# Altium schematic sheet PFC_Interleaved_V8.1.SchDoc
size 889 x 762 mm
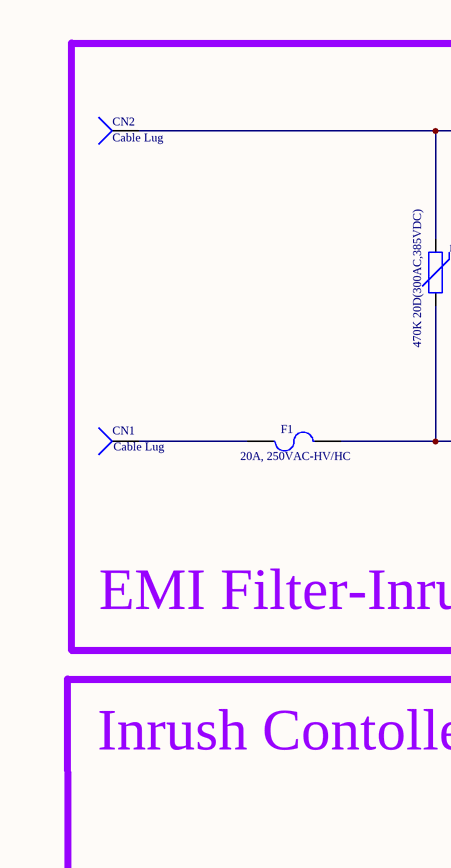
[diagram p0: PFC_Interleaved_V8.1.SchDoc, top left]
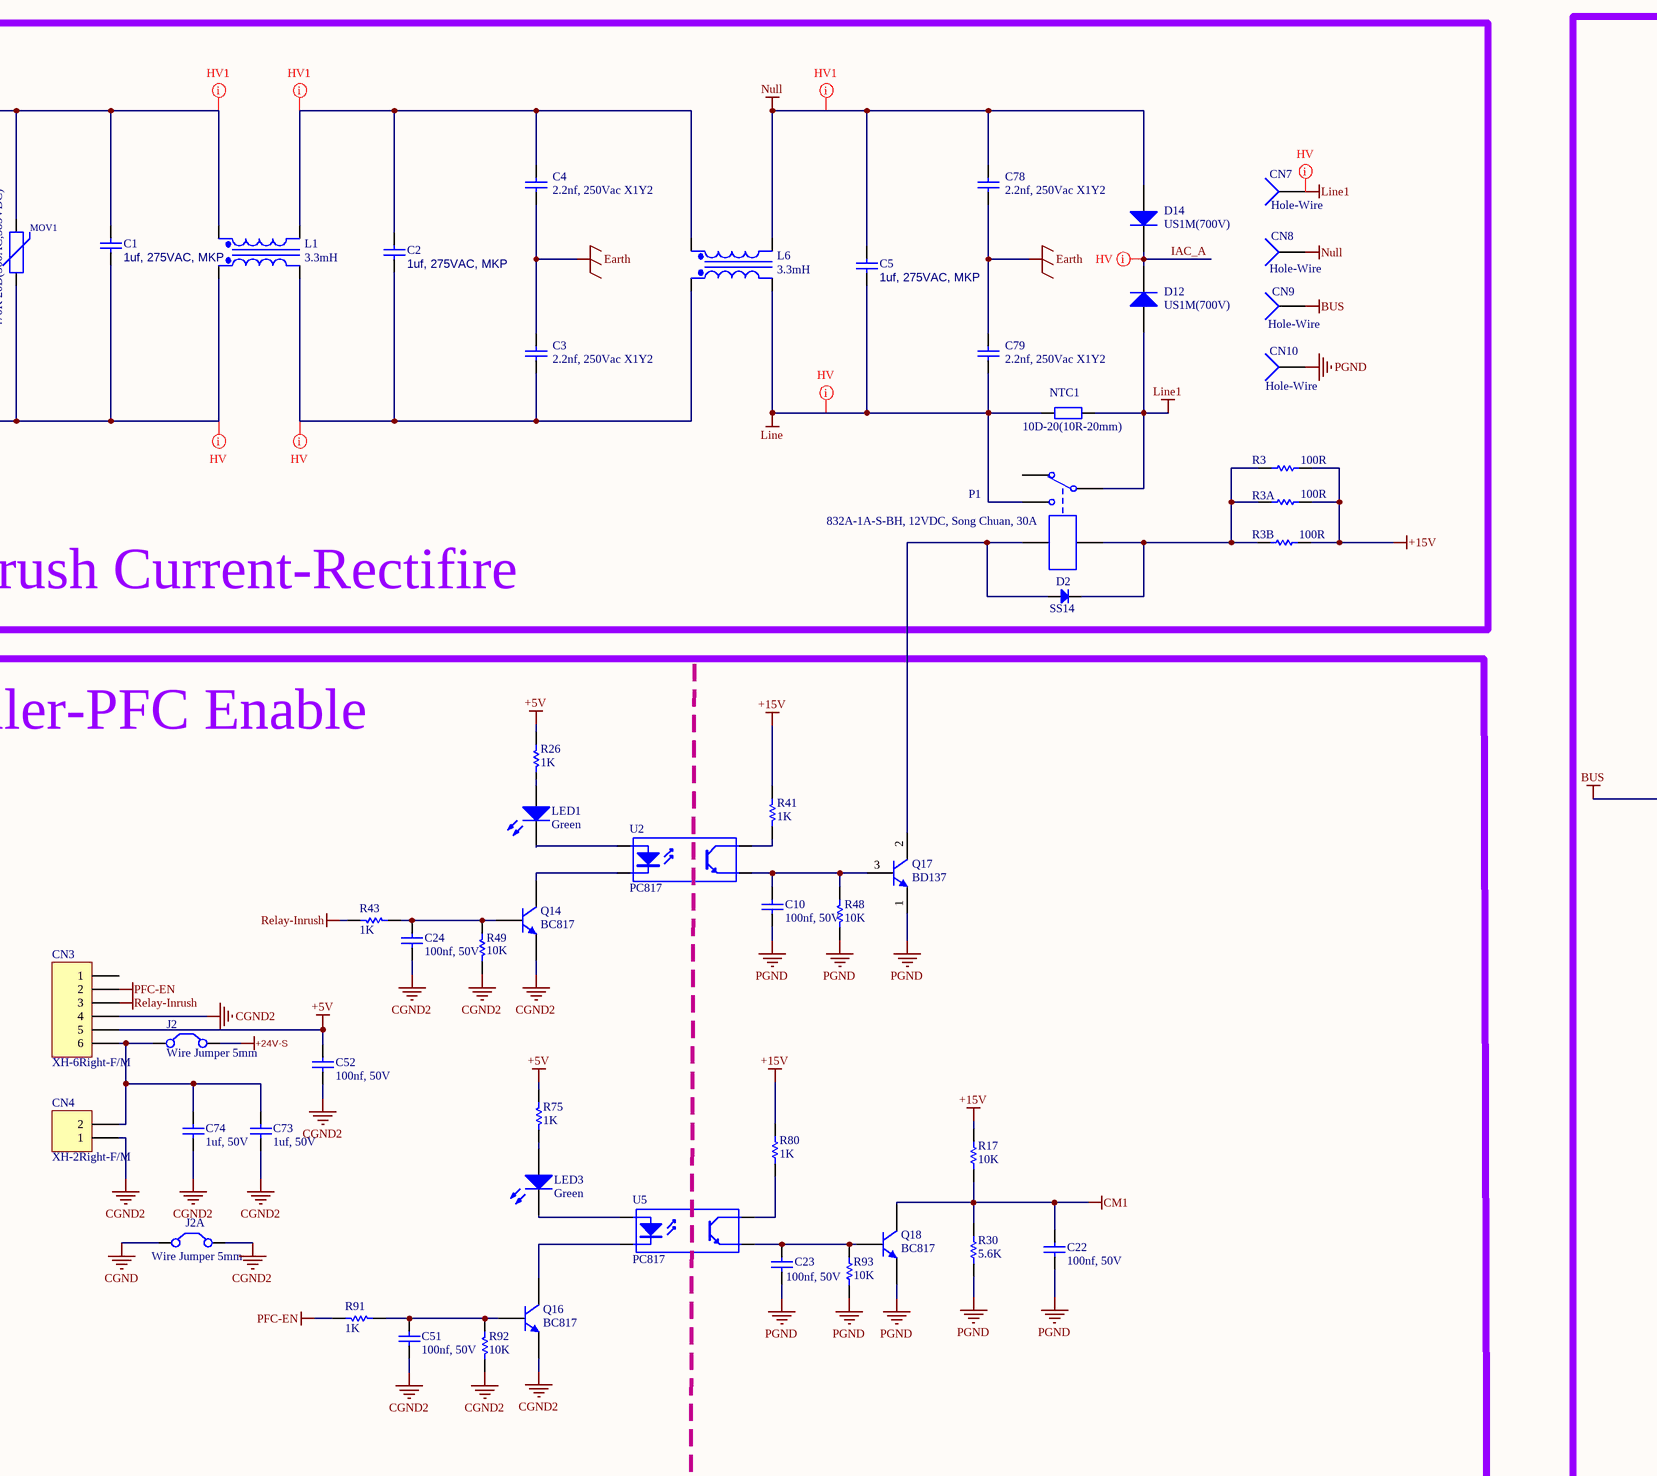
[diagram p1: PFC_Interleaved_V8.1.SchDoc, top middle]
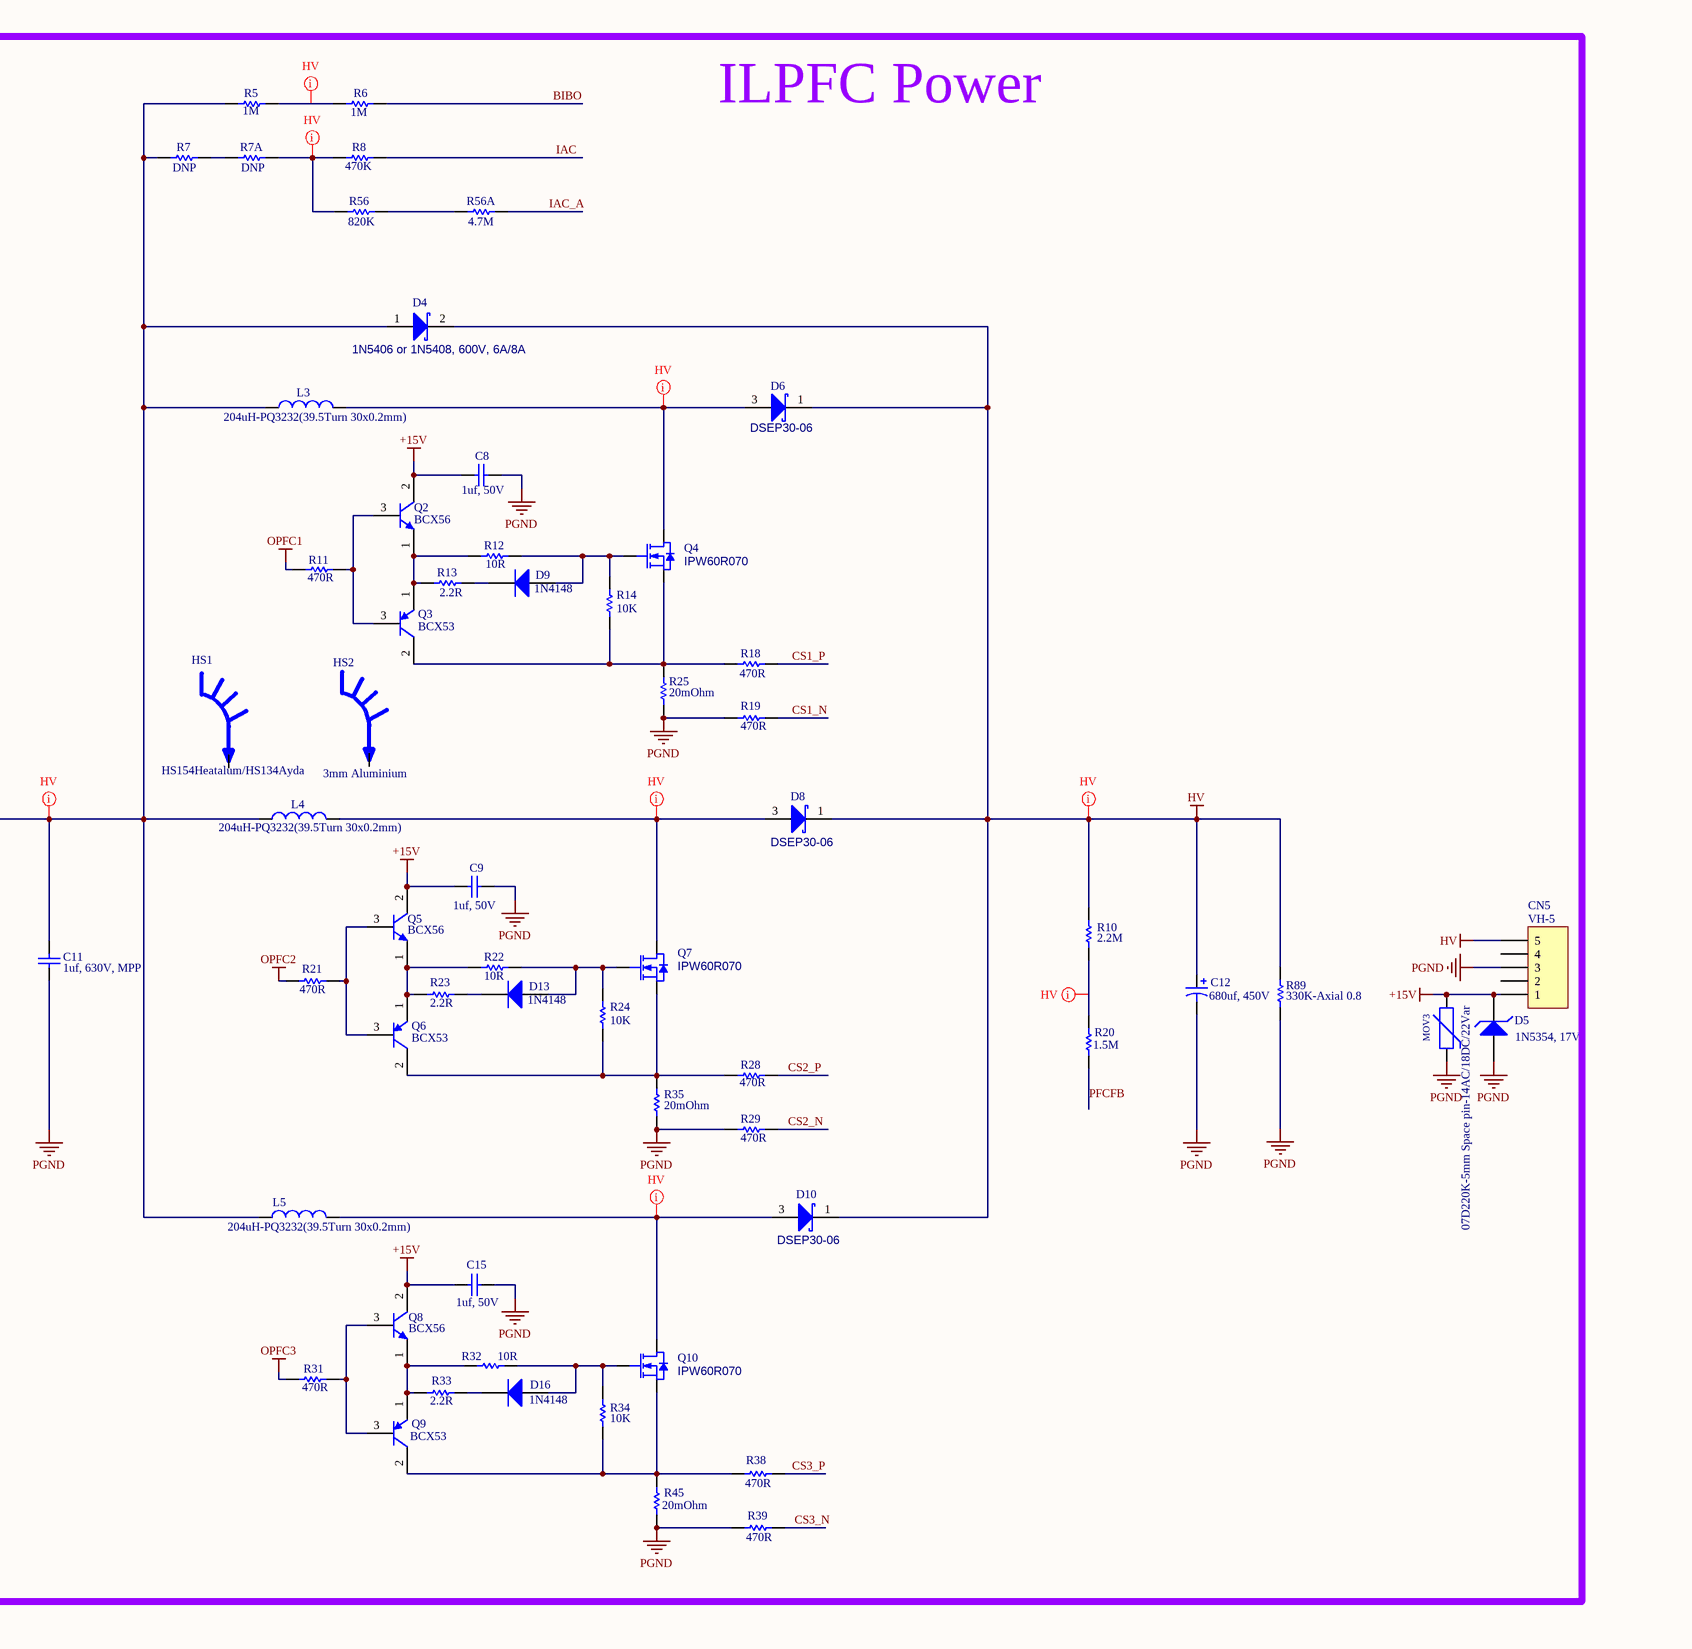
[diagram p2: PFC_Interleaved_V8.1.SchDoc, top right]
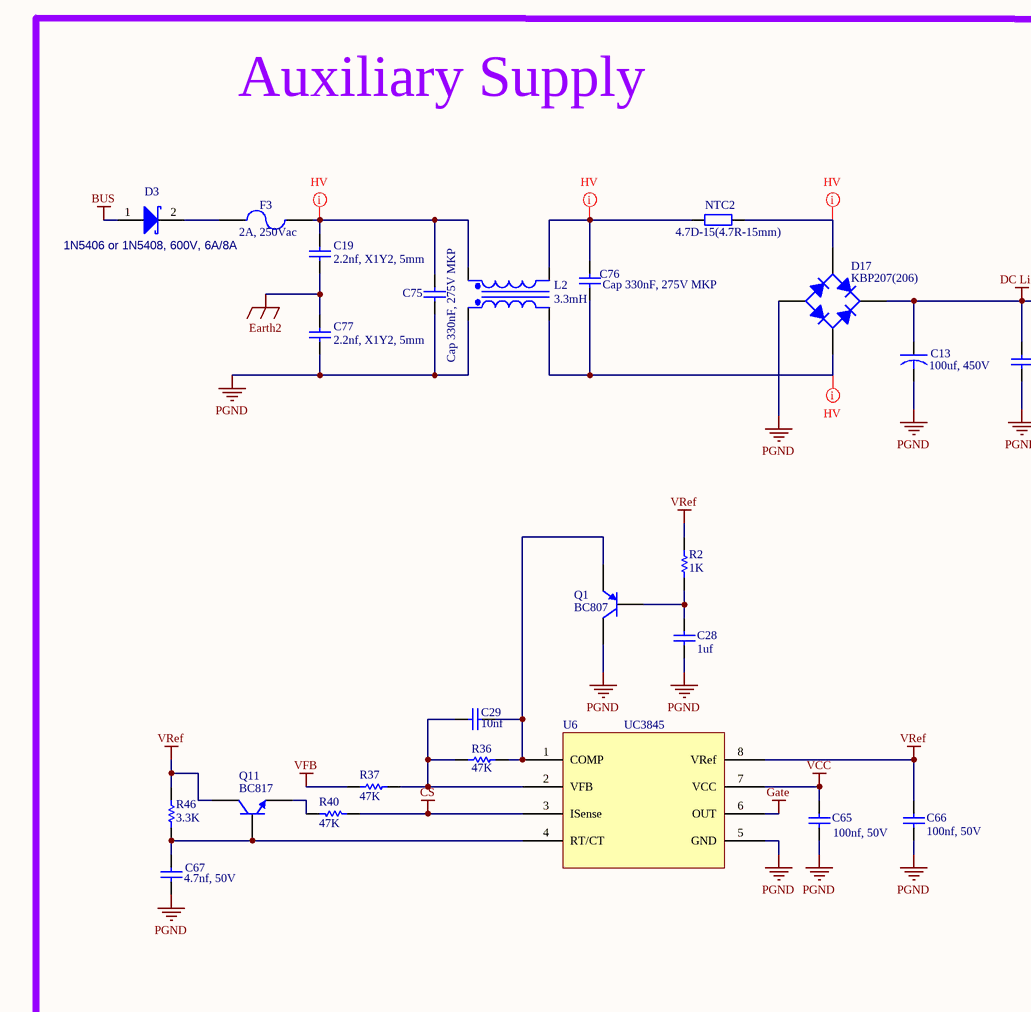
[diagram p3: PFC_Interleaved_V8.1.SchDoc, bottom left]
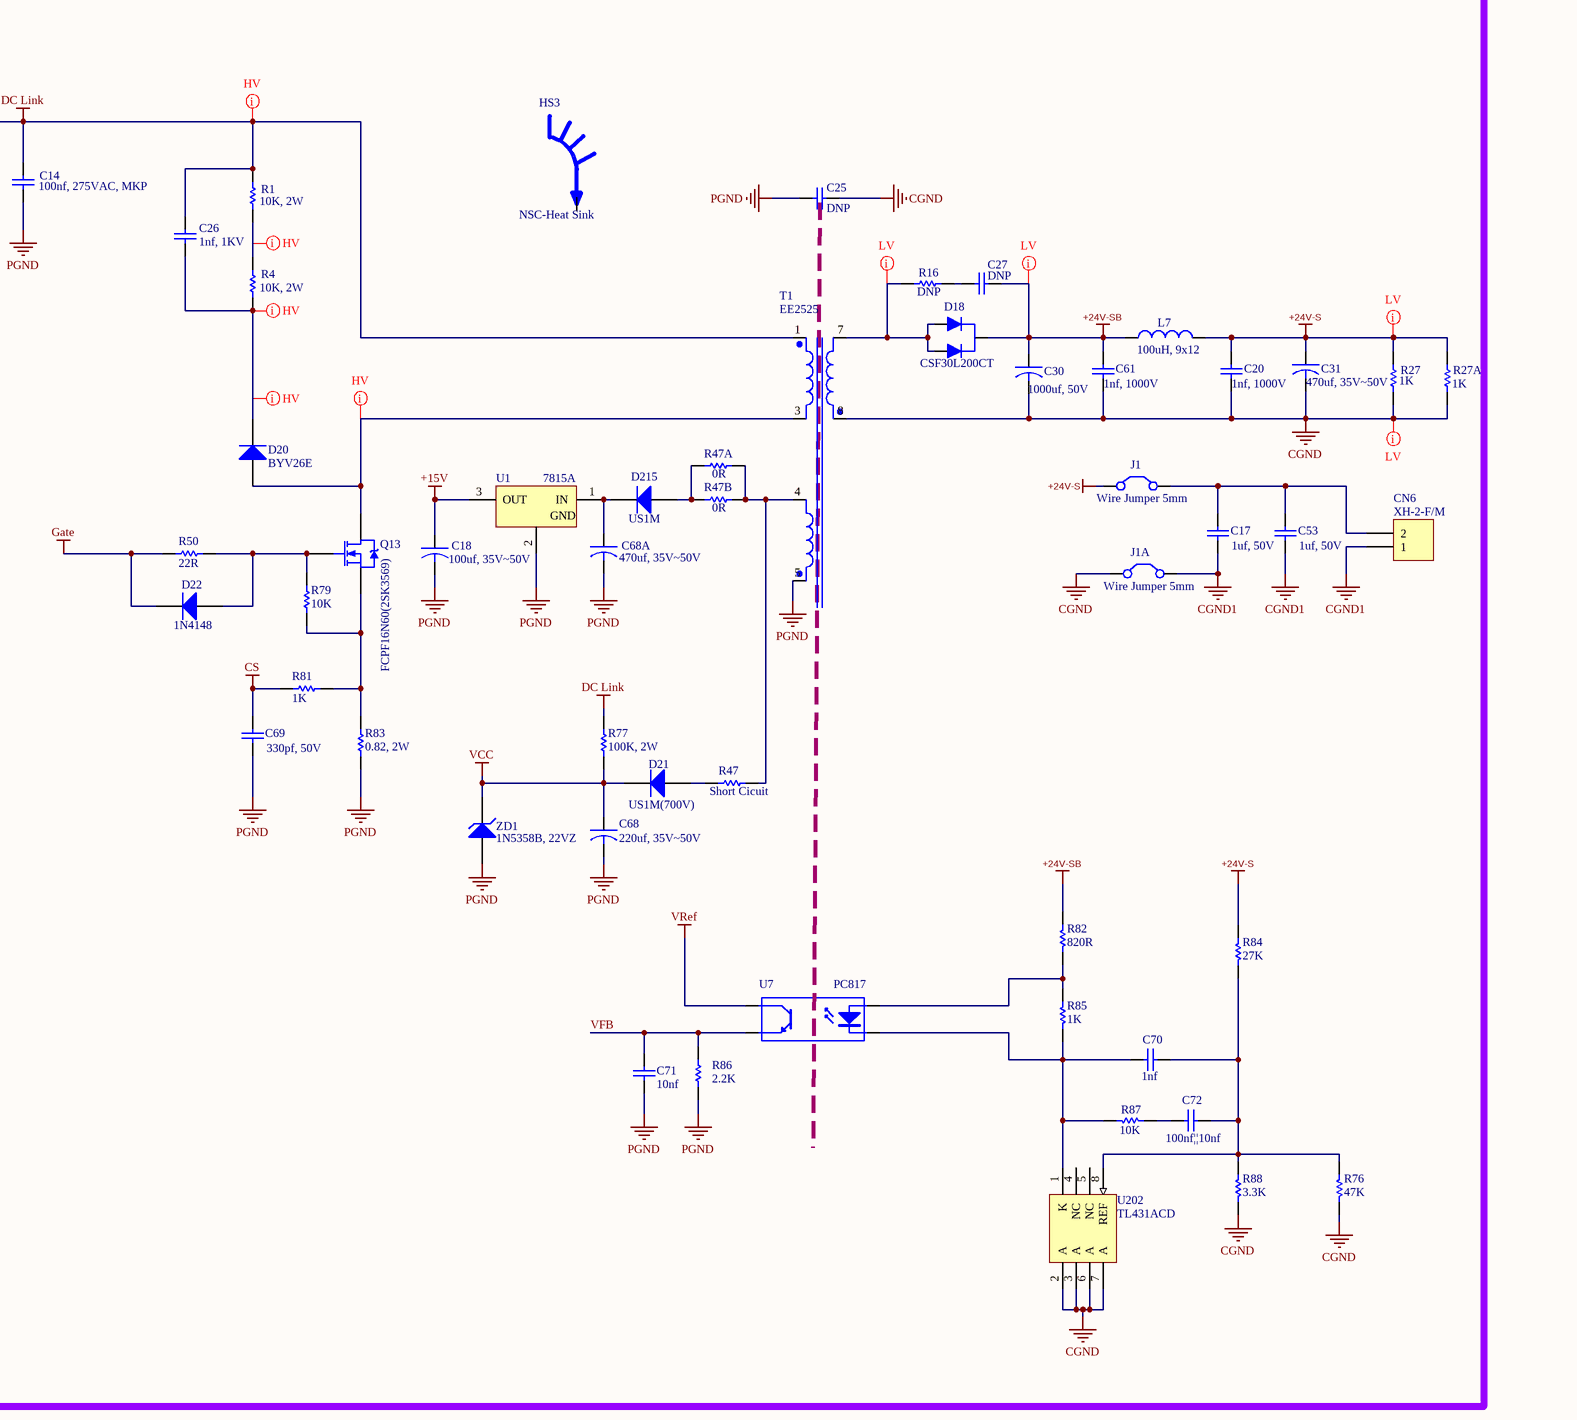
[diagram p4: PFC_Interleaved_V8.1.SchDoc, bottom middle]
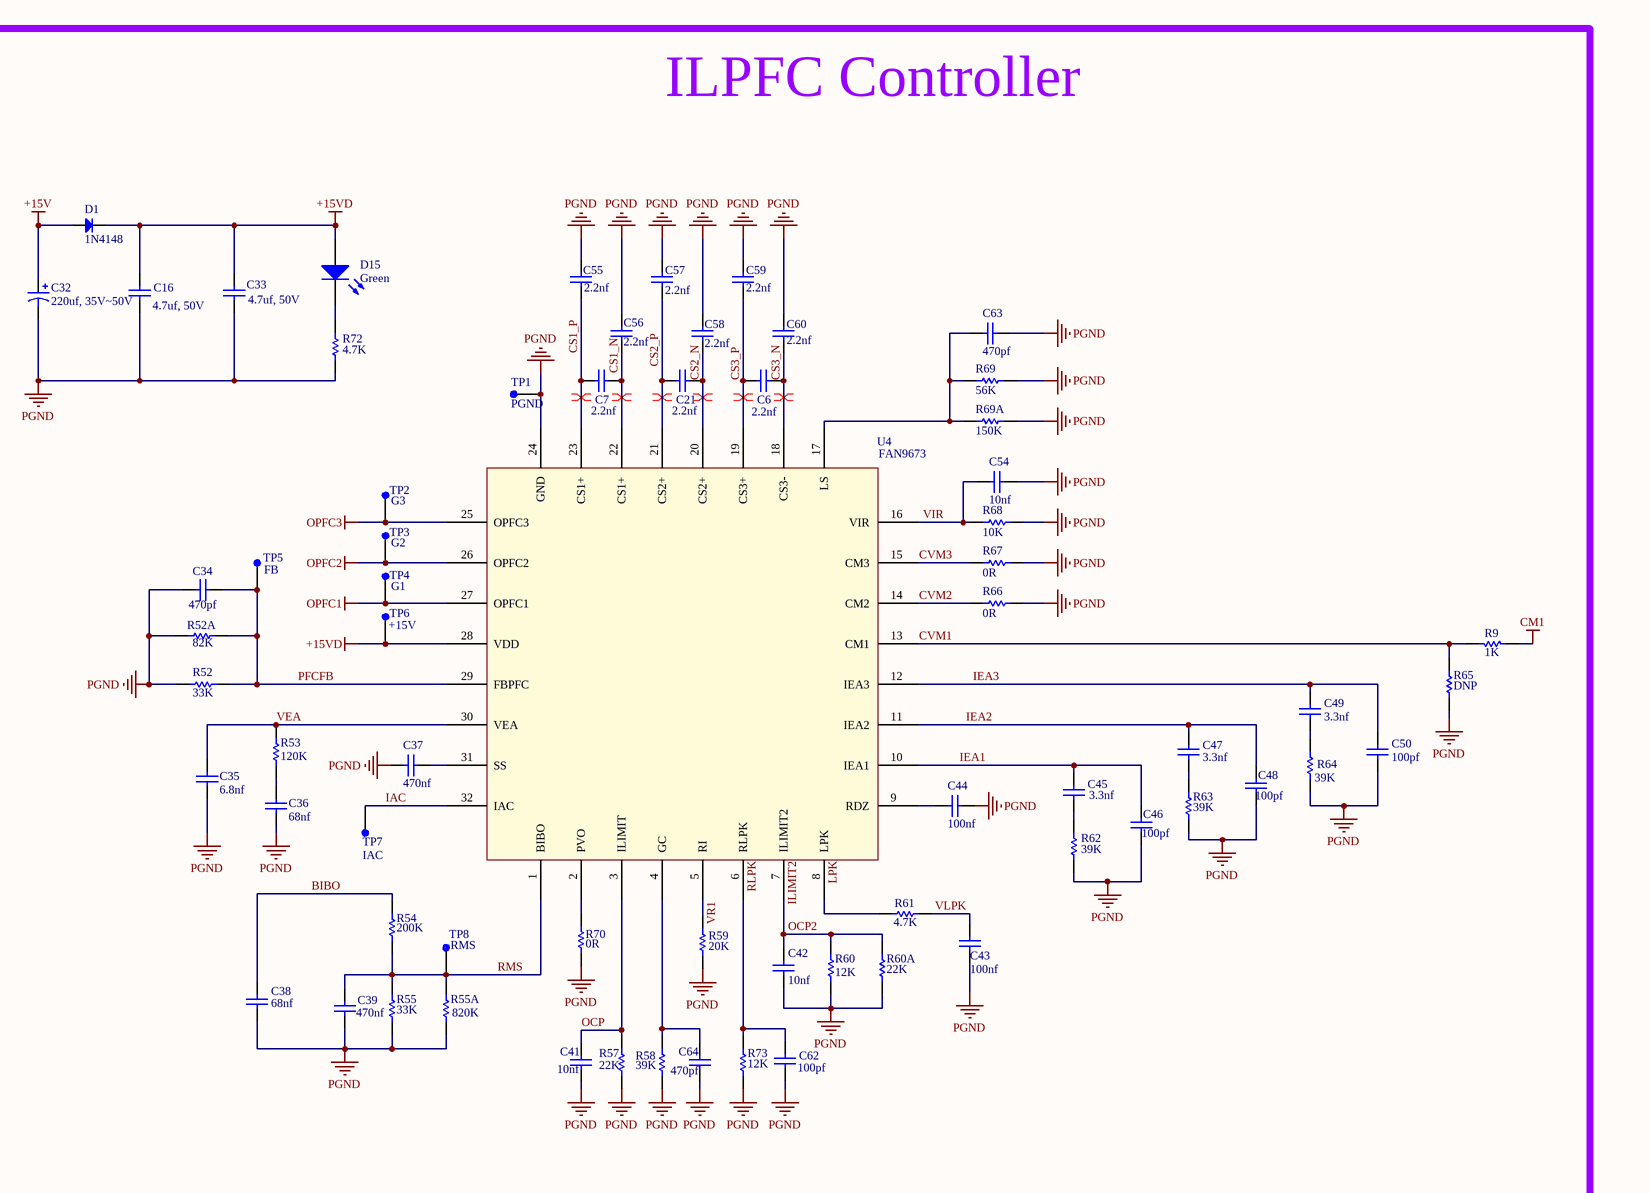
[diagram p5: PFC_Interleaved_V8.1.SchDoc, bottom right]

## Parts
C1  1uf, 275VAC, MKP  [CAP-15mm-22mm-MKT-Qourum]
C2  1uf, 275VAC, MKP  [CAP-15mm-22mm-MKT-Qourum]
C3  2.2nf, 250Vac X1Y2  [CAP-RAD-7.5mm-PFC]
C4  2.2nf, 250Vac X1Y2  [CAP-RAD-7.5mm-PFC]
C5  1uf, 275VAC, MKP  [CAP-15mm-22mm-MKT-Qourum]
C6  2.2nf  [C-0805]
C7  2.2nf  [C-0805]
C8  1uf, 50V  [C-0805]
C9  1uf, 50V  [C-0805]
C10  100nf, 50V  [C-0805]
C11  1uf, 630V, MPP  [CAP-15mm-22mm-MKT-Qourum-2]
C12  680uf, 450V  [Cap-electrolytic-680uF-2]
C13  100uf, 450V  [Cap RAD7.5-16x35-2]
C14  100nf, 275VAC, MKP  [RAD-0.4-AUX]
C15  1uf, 50V  [C-0805]
C16  4.7uf, 50V  [C-1206]
C17  1uf, 50V  [C-0805]
C18  100uf, 35V~50V  [Cap_Electrolytic5]
C19  2.2nf, X1Y2, 5mm  [Cap-TH-5mm]
C20  1nf, 1000V  [C-1206]
C21  2.2nf  [C-0805]
C22  100nf, 50V  [C-0805]
C23  100nf, 50V  [C-0805]
C24  100nf, 50V  [C-0805]
C25  Assembly: DNP  [RAD-0.2-S-2]  (hidden comment: 1nf, 1KV)
C26  1nf, 1KV  [CAP RAD-0.2]
C27  Assembly: DNP  [RAD-0.2-S-2]  (hidden comment: 1nf, 1KV)
C28  1uf  [C-0805]
C29  10nf  [C-0805]
C30  1000uf, 50V  [Cap-Elec-12mm*25mm]
C31  470uf, 35V~50V  [Cap_Electrolytic1]
C32  220uf, 35V~50V  [CAP-Elec-8mm*12mm]
C33  4.7uf, 50V  [C-1206]
C34  470pf  [C-0805]
C35  6.8nf  [C-0805]
C36  68nf  [C-0805]
C37  470nf  [C-0805]
C38  68nf  [C-0805]
C39  470nf  [C-0805]
C41  10nf  [C-0805]
C42  10nf  [C-0805]
C43  100nf  [C-0805]
C44  100nf  [C-0805]
C45  3.3nf  [C-0805]
C46  100pf  [C-0805]
C47  3.3nf  [C-0805]
C48  100pf  [C-0805]
C49  3.3nf  [C-0805]
C50  100pf  [C-0805]
C51  100nf, 50V  [C-0805]
C52  100nf, 50V  [C-0805]
C53  1uf, 50V  [C-0805]
C54  10nf  [C-0805]
C55  2.2nf  [C-0805]
C56  2.2nf  [C-0805]
C57  2.2nf  [C-0805]
C58  2.2nf  [C-0805]
C59  2.2nf  [C-0805]
C60  2.2nf  [C-0805]
C61  1nf, 1000V  [C-1206]
C62  100pf  [C-0805]
C63  470pf  [C-0805]
C64  470pf  [C-0805]
C65  100nf, 50V  [C-0805]
C66  100nf, 50V  [C-0805]
C67  4.7nf, 50V  [C-0805]
C68  220uf, 35V~50V  [CAP-Elec-8mm*12mm]
C68A  470uf, 35V~50V  [CAP-Elec-10mm*20mm]
C69  330pf, 50V  [R-0805]
C70  1nf  [C-0805]
C71  10nf  [C-0805]
C72  100nf||10nf  [C-0805]
C73  1uf, 50V  [C-0805]
C74  1uf, 50V  [C-0805]
C75  Cap 330nF, 275V MKP  [Cap-X-2]
C76  Cap 330nF, 275V MKP  [Cap-X-2]
C77  2.2nf, X1Y2, 5mm  [Cap-TH-5mm]
C78  2.2nf, 250Vac X1Y2  [CAP-RAD-7.5mm-PFC]
C79  2.2nf, 250Vac X1Y2  [CAP-RAD-7.5mm-PFC]
CN1  Cable Lug  [Connector-Lug]
CN2  Cable Lug  [Connector-Lug]
CN3  XH-6Right-F/M  [Connector-XH-6]
CN4  XH-2Right-F/M  [Connector-XH-2]
CN5  VH-5  [PWL_5]
CN6  XH-2-F/M  [Connector-XH-2]
CN7  Hole-Wire  [Connector-Lug-2]
CN8  Hole-Wire  [Connector-Lug-2]
CN9  Hole-Wire  [Connector-Lug-2]
CN10  Hole-Wire  [Connector-Lug-2]
D1  1N4148  [SOD-123-2]
D2  SS14  [DO-214AC-SMA-2]
D3  1N5406 or 1N5408, 600V, 6A/8A  [MUR460]
D4  1N5406 or 1N5408, 600V, 6A/8A  [MUR460]
D5  1N5354, 17V  [Diode-AXIAL-12mm-1200V]
D6  DSEP30-06  [TO247-2Pin-PFC-HC]
D8  DSEP30-06  [TO247-2Pin-PFC-HC]
D9  1N4148  [SOD-123-2]
D10  DSEP30-06  [TO247-2Pin-PFC-HC]
D12  US1M(700V)  [DO-214AC-SMA-2]
D13  1N4148  [SOD-123-2]
D14  US1M(700V)  [DO-214AC-SMA-2]
D15  Green  [LED-0805]
D16  1N4148  [SOD-123-2]
D17  KBP207(206)  [DiodeBridge_KBP210]
D18  CSF30L200CT  [TO220F-Bent-Leg]
D20  BYV26E  [Diode_Vertical3]
D21  US1M(700V)  [DO-214AC-SMA-2]
D22  1N4148  [SOD-123-2]
D215  US1M  [DO-214AC-SMA-2]
F1  20A, 250VAC-HV/HC  [Fuse 5x20_V2]
F3  2A, 250Vac  [Fuse Combination]
HS1  HS154Heatalum/HS134Ayda  [HeatSink-HC-1]
HS2  3mm Aluminium  [HeatSink-HC--PFC-2]
HS3  NSC-Heat Sink  [HeatSink12]
J1  Wire Jumper 5mm  [Jumper-5mm]
J1A  Wire Jumper 5mm  [Jumper-5mm]
J2  Wire Jumper 5mm  [Jumper-5mm]
J2A  Wire Jumper 5mm  [Jumper-5mm]
L1  3.3mH  [Common Mode inductor-3]
L2  3.3mH  [Trans line small-2]
L3  204uH-PQ3232(39.5Turn 30x0.2mm)  [TRANS-PQ3535-2]
L4  204uH-PQ3232(39.5Turn 30x0.2mm)  [TRANS-PQ3535-4]
L5  204uH-PQ3232(39.5Turn 30x0.2mm)  [TRANS-PQ3535-6]
L6  3.3mH  [Common Mode inductor-3]
L7  100uH, 9x12  [Inductor-Bar-P5-D10]
LED1  Green  [LED-0805]
LED3  Green  [LED-0805]
MOV1  470K 20D(300AC,385VDC)  [VDR-20D]
MOV3  07D220K-5mm Space pin-14AC/18DC/22Var  [VAR-7D-5mm-1200V]
NTC1  10D-20(10R-20mm)  [VDR-20D]
NTC2  4.7D-15(4.7R-15mm)  [NTC-8mm]
P1  832A-1A-S-BH, 12VDC, Song Chuan, 30A  [832A1AS12VDCVDE-K]
Q1  BC807  [SOT-23]
Q2  BCX56  [SOT89L-K]
Q3  BCX53  [SOT89L-K]
Q4  IPW60R070  [TO247-3Pin-PFC-HC-1]
Q5  BCX56  [SOT89L-K]
Q6  BCX53  [SOT89L-K]
Q7  IPW60R070  [TO247-3Pin-PFC-HC-1]
Q8  BCX56  [SOT89L-K]
Q9  BCX53  [SOT89L-K]
Q10  IPW60R070  [TO247-3Pin-PFC-HC-1]
Q11  BC817  [SOT-23]
Q13  FCPF16N60(2SK3569)  [TO220F-Bent-Leg]
Q14  BC817  [MSOT-23]
Q16  BC817  [MSOT-23]
Q17  BD137  [BD137-K]
Q18  BC817  [MSOT-23]
R1  10K, 2W  [Resistor_Vertical3]
R2  1K  [R-0805]
R3  100R  [R-1206]
R3A  100R  [R-1206]
R3B  100R  [R-1206]
R4  10K, 2W  [Resistor_Vertical3]
R5  1M  [R-1206]
R6  1M  [R-1206]
R7  Assembly: DNP  [R-1206]  (hidden comment: 6M)
R7A  Assembly: DNP  [R-1206]  (hidden comment: 0R)
R8  470K  [R-1206]
R9  1K  [R-0805]
R10  2.2M  [R-1206]
R11  470R  [R-0805]
R12  10R  [R-0805]
R13  2.2R  [R-0805]
R14  10K  [R-0805]
R16  Assembly: DNP  [R-1206]  (hidden comment: 10R)
R17  10K  [R-0805]
R18  470R  [R-0805]
R19  470R  [R-0805]
R20  1.5M  [R-1206]
R21  470R  [R-0805]
R22  10R  [R-0805]
R23  2.2R  [R-0805]
R24  10K  [R-0805]
R25  20mOhm  [R-2512]
R26  1K  [R-0805]
R27  1K  [R-1206]
R27A  1K  [R-1206]
R28  470R  [R-0805]
R29  470R  [R-0805]
R30  5.6K  [R-0805]
R31  470R  [R-0805]
R32  10R  [R-0805]
R33  2.2R  [R-0805]
R34  10K  [R-0805]
R35  20mOhm  [R-2512]
R36  47K  [R-0805]
R37  47K  [R-0805]
R38  470R  [R-0805]
R39  470R  [R-0805]
R40  47K  [R-0805]
R41  1K  [R-0805]
R43  1K  [R-0805]
R45  20mOhm  [R-2512]
R46  3.3K  [R-0805]
R47  Short Cicuit  [R-1206]
R47A  0R  [R-1206]
R47B  0R  [R-1206]
R48  10K  [R-0805]
R49  10K  [R-0805]
R50  22R  [R-0805]
R52  33K  [R-0805]
R52A  82K  [R-0805]
R53  120K  [R-0805]
R54  200K  [R-1206]
R55  33K  [R-0805]
R55A  820K  [R-0805]
R56  820K  [R-1206]
R56A  4.7M  [R-1206]
R57  22K  [R-0805]
R58  39K  [R-0805]
R59  20K  [R-0805]
R60  12K  [R-0805]
R60A  22K  [R-0805]
R61  4.7K  [R-0805]
R62  39K  [R-0805]
R63  39K  [R-0805]
R64  39K  [R-0805]
R65  Assembly: DNP  [R-0805]  (hidden comment: 0R)
R66  0R  [R-0805]
R67  0R  [R-0805]
R68  10K  [R-0805]
R69  56K  [R-0805]
R69A  150K  [R-0805]
R70  0R  [R-0805]
R72  4.7K  [R-0805]
R73  12K  [R-0805]
R75  1K  [R-0805]
R76  47K  [R-0805]
R77  100K, 2W  [Resistor_Vertical3]
R79  10K  [R-0805]
R80  1K  [R-0805]
R81  1K  [R-0805]
R82  820R  [R-0805]
R83  0.82, 2W  [Resistor_Vertical3]
R84  27K  [R-0805]
R85  1K  [R-0805]
R86  2.2K  [R-0805]
R87  10K  [R-0805]
R88  3.3K  [R-0805]
R89  330K-Axial 0.8  [Res DC Link  axial 0.6]
R91  1K  [R-0805]
R92  10K  [R-0805]
R93  10K  [R-0805]
T1  EE2525  [EE2525_Comb4]
TP1  PGND  [Test-Point]
TP2  G3  [Test-Point]
TP3  G2  [Test-Point]
TP4  G1  [Test-Point]
TP5  FB  [Test-Point]
TP6  +15V  [Test-Point]
TP7  IAC  [Test-Point]
TP8  RMS  [Test-Point]
U1  7815A  [TO220F-Bent-Leg]
U2  PC817  [DIP_4]
U4  FAN9673  [LQFP-32-FAN9673]
U5  PC817  [DIP_4]
U6  UC3845  [So-8-W-L-fly]
U7  PC817  [DIP_4]
U202  TL431ACD  [so8+sot23]
ZD1  1N5358B, 22VZ  [Diode_Vertical3]

## Blocks framed on the sheet
EMI Filter-Inrush Current-Rectifire: C1-C5 C78 C79 CN1 CN2 CN7-CN10 D2 D12 D14 F1 L1 L6 MOV1 NTC1 P1 R3 R3A R3B
ILPFC Power: C8 C9 C11 C12 C15 CN5 D4-D6 D8-D10 D13 D16 HS1 HS2 L3-L5 MOV3 Q2-Q10 R5-R7 R7A R8 R10-R14 R18-R25 R28 R29 R31-R35 R38 R39 R45 R56 R56A R89
Inrush Contoller-PFC Enable: C10 C22-C24 C51 C52 C73 C74 CN3 CN4 J2 J2A LED1 LED3 Q14 Q16-Q18 R17 R26 R30 R41 R43 R48 R49 R75 R80 R91-R93 U2 U5
Auxiliary Supply: C13 C14 C17-C20 C25-C31 C53 C61 C65-C68 C68A C69-C72 C75-C77 CN6 D3 D17 D18 D20-D22 D215 F3 HS3 J1 J1A L2 L7 NTC2 Q1 Q11 Q13 R1 R2 R4 R16 R27 R27A R36 R37 R40 R46 R47 R47A R47B R50 R76 R77 R79 R81-R88 T1 U1 U6 U7 U202 ZD1
ILPFC Controller: C6 C7 C16 C21 C32-C39 C41-C50 C54-C60 C62-C64 D1 D15 R9 R52 R52A R53-R55 R55A R57-R60 R60A R61-R69 R69A R70 R72 R73 TP1-TP8 U4

## Nets
+5V: C52.1 CN3.5 R26.2 R75.2
+15V: C8.1 C9.1 C15.1 C18.1 C32.1(+) CN5.1 D1.1(A) D5.2(K) MOV3.1 Q2.2(C) Q5.2(C) Q8.2(C) R3.2 R3A.2 R3B.2 R17.1 R41.2 R80.1 U1.3(OUT)
+15VD: C16.2 C33.2 D1.2(K) D15.1(A) TP6.1 U4.28(VDD)
+24V-S: C20.2 C31.1 J1.1(C1) J2.1(C1) L7.2 R27.2 R27A.2 R84.2
+24V-SB: C27.1 C30.1 C61.2 D18.2(K) L7.1 R82.2
BUS: C11.2 CN9.1 D3.1 D4.1 L3.2 L4.2 L5.2 R5.2 R7.2
CGND: C20.1 C25.1 C30.2 C31.2 C61.1 J1A.2(C2) J2A.2(C2) R27.1 R27A.1 R76.1 R88.1 T1.8 U202.2(A) U202.3(A) U202.6(A) U202.7(A)
CGND1: C17.1 C53.1 CN6.1 J1A.1(C1)
CGND2: C24.2 C51.2 C52.2 C73.1 C74.1 CN3.4 CN4.1 J2A.1(C1) Q14.2(E) Q16.2(E) R49.2 R92.2
CM1: C22.1 Q18.3(C) R9.2 R17.2 R30.1
CS: C69.2 R40.1 R81.1 U6.3(ISense)
DC Link: C13.1 C14.2 C26.2 D17.1(K) R1.1 R77.1 T1.1
Earth: C3.1 C4.1 C78.1 C79.1
Earth2: C19.1 C77.2
Gate: D22.2(K) R50.2 U6.6(OUT)
HV: C12.1(+) CN5.5 D4.2 D6.1 D8.1 D10.1 R10.2 R89.2
Line: C5.2 C79.2 L6.2(Pri-) NTC1.1 P1.2
Line1: CN7.1 D12.1(A) NTC1.2 P1.3
Null: C5.1 C78.2 CN8.1 D14.1(A) L6.4(Sec-)
OPFC1: R11.2 TP4.1 U4.27(OPFC1)
OPFC2: R21.2 TP3.1 U4.26(OPFC2)
OPFC3: R31.2 TP2.1 U4.25(OPFC3)
PFC-EN: CN3.2 R91.1
PGND: C8.2 C9.2 C10.1 C11.1 C12.2(-) C13.2 C14.1 C15.2 C16.1 C18.2 C22.2 C23.2 C25.2 C28.1 C32.2(-) C33.1 C34.2 C35.1 C36.1 C37.1 C38.1 C39.1 C41.1 C42.1 C43.1 C44.1 C46.1 C48.1 C50.1 C54.1 C55.2 C56.2 C57.2 C58.2 C59.2 C60.2 C62.1 C63.1 C64.1 C65.1 C66.1 C67.1 C68.2 C68A.2 C69.1 C71.1 C75.1 C77.1 CN5.3 CN10.1 D5.1(A) D17.4(A) L2.3(Sec+) MOV3.2 Q1.3(C) Q17.1(E) Q18.2(E) R19.2 R25.1 R29.2 R30.2 R35.1 R39.2 R45.1 R48.1 R52.1 R52A.1 R55.2 R55A.2 R57.2 R58.2 R59.2 R60.2 R60A.2 R62.1 R63.1 R64.1 R65.1 R66.1 R67.1 R68.1 R69.1 R69A.1 R70.1 R72.1 R73.2 R83.2 R86.1 R89.1 R93.2 T1.5 TP1.1 U1.2(GND) U4.24(GND) U6.5(GND) ZD1.1(A)
Relay-Inrush: CN3.3 R43.1
VCC: C65.2 C68.1 D21.2(K) R77.2 U6.7(VCC) ZD1.2(K)
VFB: C71.2 R37.2 R86.2 U7.3(E)
VRef: C66.2 Q11.3(C) R2.2 R46.1 U6.8(VRef) U7.4(C)
BIBO: C38.2 R6.1 R54.1
CS1_N: C7.1 C56.1 R19.1 U4.22(CS1+)
CS1_P: C7.2 C55.1 R18.1 U4.23(CS1+)
CS2_N: C21.1 C58.1 R29.1 U4.20(CS2+)
CS2_P: C21.2 C57.1 R28.1 U4.21(CS2+)
CS3_N: C6.1 C60.1 R39.1 U4.18(CS3-)
CS3_P: C6.2 C59.1 R38.1 U4.19(CS3+)
CVM1: R9.1 R65.2 U4.13(CM1)
CVM2: R66.2 U4.14(CM2)
CVM3: R67.2 U4.15(CM3)
IAC: R8.1 TP7.1 U4.32(IAC)
IAC_A: D12.2(K) D14.2(K) R56A.1
IEA1: C45.2 C46.2 U4.10(IEA1)
IEA2: C47.2 C48.2 U4.11(IEA2)
IEA3: C49.2 C50.2 U4.12(IEA3)
OCP: C41.2 R57.1 U4.3(ILIMIT)
OCP2: C42.2 R60.1 R60A.1 U4.7(ILIMIT2)
PFCFB: C34.1 R20.1 R52.2 R52A.2 TP5.1 U4.29(FBPFC)
RMS: C39.2 R54.2 R55.1 R55A.1 TP8.1 U4.1(BIBO)
VEA: C35.2 R53.2 U4.30(VEA)
VIR: C54.2 R68.2 U4.16(VIR)
VLPK: C43.2 R61.2
VR1: R59.1 U4.5(RI)
NetC1_1: C1.1 CN2.1 L1.1(Pri+) MOV1.2
NetC1_2: C1.2 F1.2 L1.3(Sec+) MOV1.1
NetC2_1: C2.1 C4.2 L1.2(Pri-) L6.3(Sec+)
NetC2_2: C2.2 C3.2 L1.4(Sec-) L6.1(Pri+)
NetC10_2: C10.2 Q17.3(B) R48.2 U2.3(E)
NetC17_2: C17.2 C53.2 CN6.2 J1.2(C2)
NetC19_2: C19.2 C75.2 F3.2 L2.1(Pri+)
NetC23_1: C23.1 Q18.1(B) R93.1 U5.3(E)
NetC24_1: C24.1 Q14.1(B) R43.2 R49.1
NetC26_1: C26.1 D20.2(K) R4.1
NetC27_2: C27.2 R16.1
NetC28_2: C28.2 Q1.1(B) R2.1
NetC29_1: C29.1 R36.2 R37.1 U6.2(VFB)
NetC29_2: C29.2 Q1.2(E) R36.1 U6.1(COMP)
NetC36_2: C36.2 R53.1
NetC37_2: C37.2 U4.31(SS)
NetC44_2: C44.2 U4.9(RDZ)
NetC45_1: C45.1 R62.2
NetC47_1: C47.1 R63.2
NetC49_1: C49.1 R64.2
NetC51_1: C51.1 Q16.1(B) R91.2 R92.1
NetC62_2: C62.2 R73.1 U4.6(RLPK)
NetC63_2: C63.2 R69.2 R69A.2 U4.17(LS)
NetC64_2: C64.2 R58.1 U4.4(GC)
NetC67_2: C67.2 Q11.1(B) R46.2 U6.4(RT/CT)
NetC68A_1: C68A.1 D215.2(K) U1.1(IN)
NetC70_1: C70.1 R85.2 R87.1 U7.2(K) U202.1(K)
NetC70_2: C70.2 C72.2 R76.2 R84.1 R88.2 U202.8(REF)
NetC72_1: C72.1 R87.2
NetC73_2: C73.2 C74.2 CN3.6 CN4.2 J2.2(C2)
NetC76_1: C76.1 D17.3(C) L2.4(Sec-)
NetC76_2: C76.2 L2.2(Pri-) NTC2.1
NetCN1_1: CN1.1 F1.1
NetD2_1: D2.1(A) P1.4 Q17.2(C)
NetD2_2: D2.2(K) P1.5 R3.1 R3A.1 R3B.1
NetD3_2: D3.2 F3.1
NetD6_3: D6.3 L3.1 Q4.2(D)
NetD8_3: D8.3 L4.1 Q7.2(D)
NetD9_1: D9.1(A) Q4.1(G) R12.1 R14.2
NetD9_2: D9.2(K) R13.2
NetD10_3: D10.3 L5.1 Q10.2(D)
NetD13_1: D13.1(A) Q7.1(G) R22.1 R24.2
NetD13_2: D13.2(K) R23.2
NetD15_2: D15.2(K) R72.2
NetD16_1: D16.1(A) Q10.1(G) R32.1 R34.2
NetD16_2: D16.2(K) R33.2
NetD17_2: D17.2(C) NTC2.2
NetD18_1: D18.1(A1) D18.3(A2) R16.2 T1.7
NetD20_1: D20.1(A) Q13.2(D) T1.3
NetD21_1: D21.1(A) R47.2
NetD22_1: D22.1(A) Q13.1(G) R50.1 R79.1
NetD215_1: D215.1(A) R47A.2 R47B.2
NetLED1_1: LED1.1(A) R26.1
NetLED1_2: LED1.2(K) U2.1(A)
NetLED3_1: LED3.1(A) R75.1
NetLED3_2: LED3.2(K) U5.1(A)
NetQ2_1: Q2.1(E) Q3.1(E) R12.2 R13.1
NetQ2_3: Q2.3(B) Q3.3(B) R11.1
NetQ3_2: Q3.2(C) Q4.3(S) R14.1 R18.2 R25.2
NetQ5_1: Q5.1(E) Q6.1(E) R22.2 R23.1
NetQ5_3: Q5.3(B) Q6.3(B) R21.1
NetQ6_2: Q6.2(C) Q7.3(S) R24.1 R28.2 R35.2
NetQ8_1: Q8.1(E) Q9.1(E) R32.2 R33.1
NetQ8_3: Q8.3(B) Q9.3(B) R31.1
NetQ9_2: Q9.2(C) Q10.3(S) R34.1 R38.2 R45.2
NetQ11_2: Q11.2(E) R40.2
NetQ13_3: Q13.3(S) R79.2 R81.2 R83.1
NetQ14_3: Q14.3(C) U2.2(K)
NetQ16_3: Q16.3(C) U5.2(K)
NetR1_2: R1.2 R4.2
NetR5_1: R5.1 R6.2
NetR7_1: R7.1 R7A.2
NetR7A_1: R7A.1 R8.2 R56.2
NetR10_1: R10.1 R20.2
NetR41_1: R41.1 U2.4(C)
NetR47_1: R47.1 R47A.1 R47B.1 T1.4
NetR56_1: R56.1 R56A.2
NetR61_1: R61.1 U4.8(LPK)
NetR70_2: R70.2 U4.2(PVO)
NetR80_2: R80.2 U5.4(C)
NetR82_1: R82.1 R85.1 U7.1(A)

Not connected (* = marked no-connect by the designer): CN3 1; CN5 2 4; HS1 1; HS2 1; HS3 1; P1 1(2); U202 4(NC) 5(NC)

## Layout directives
net class HighVoltage: BUS, DC Link, HV, IAC_A, Line, Line1, NetC1_2, NetC2_2, NetC19_2, NetC26_1, NetC76_1, NetC76_2, NetD6_3, NetD8_3, NetD10_3, NetD17_2, NetD20_1, NetR1_2, NetR5_1, NetR7A_1, NetR10_1
net class HighVoltage1: NetC1_1, NetC2_1, Null
differential pair: CS1_N, CS1_P, CS2_N, CS2_P, CS3_N, CS3_P
net class LowVoltage: +24V-S, +24V-SB, CGND, NetD18_1

## Notes on the sheet
- Labels drawn without touching a wire or pin: ILIMIT2, LPK, RLPK

## Library data of the parts
C1 C2 C5 = ECQ-U2A474ML: Value: 1uf, 275VAC, MKP; PackageReference: Radial 26x16x8; Category: Cap TH
C3 C4 C6 C7 C16 C21 C33-C39 C41-C50 C54-C60 C62-C64 C78 C79 = DE2E3KY222MA2BM01
  C3 C4 C78 C79: Value: 2.2nf, 250Vac X1Y2; PackageReference: Disk D8x5mm; Category: Cap TH
  C6 C7 C21 C55-C60: Value: 2.2nf; PackageReference: 0805; Category: Cap SMD
  C16 C33: Value: 4.7uf, 50V; PackageReference: 1206; Category: Cap SMD
  C34 C63 C64: Value: 470pf; PackageReference: 0805; Category: Cap SMD
  C35: Value: 6.8nf; PackageReference: 0805; Category: Cap SMD
  C36 C38: Value: 68nf; PackageReference: 0805; Category: Cap SMD
  C37 C39: Value: 470nf; PackageReference: 0805; Category: Cap SMD
  C41 C42 C54: Value: 10nf; PackageReference: 0805; Category: Cap SMD
  C43 C44: Value: 100nf; PackageReference: 0805; Category: Cap SMD
  C45 C47 C49: Value: 3.3nf; PackageReference: 0805; Category: Cap SMD
  C46 C48 C50 C62: Value: 100pf; PackageReference: 0805; Category: Cap SMD
C8-C10 C15 C19 C22-C24 C51 C52 C75-C77 = Cap 0805(2)
  C8 C9 C15: Value: 1uf, 50V; PackageReference: 0805; Category: Cap SMD
  C10 C22-C24 C51 C52: Value: 100nf, 50V; PackageReference: 0805; Category: Cap SMD
  C19 C77: Value: 2.2nf, X1Y2, 5mm; Category: Cap TH; PackageReference: Disc Pin Space 5mm
  C75 C76: Value: Cap 330nF, 275V MKP; Category: Cap TH; PackageReference: 17x8x15mm(LWH)
C11 C70 C72 = Cap Semi
  C11: PackageReference: Radial 15mmx22mm; Value: 1uf, 630V, MPP; Category: Cap TH
  C70: Value: 1nf; Category: Cap SMD; PackageReference: 0805
  C72: Value: 100nf||10nf; Category: Cap SMD; PackageReference: 0805
C12 C32 = 380LQ271M450K022: Category: Cap TH
  C12: PackageReference: Can D35x50mm; Value: 680uf, 450V
  C32: PackageReference: Can D8mmx12mm; Value: 220uf, 35V~50V
C13 C18 C30 C31 C68 C68A = CAPACITOR: Category: Cap TH
  C13: Value: 100uf, 450V; PackageReference: Can D18mmx35mm
  C18: Value: 100uf, 35V~50V; PackageReference: Can D8mmx12mm
  C30: Value: 1000uf, 50V; PackageReference: Can D12mmx25mm
  C31 C68A: Value: 470uf, 35V~50V; PackageReference: Can D10mmx20MM
  C68: Value: 220uf, 35V~50V; PackageReference: Can D8mmx12mm
C14 C17 C20 C25-C29 C53 C61 C65-C67 C69 C71 C73 C74 = Cap
  C14: Value: 100nf, 275VAC, MKP; Category: Cap TH
  C17 C53 C73 C74: Value: 1uf, 50V; Category: Cap SMD; PackageReference: 0805
  C20 C61: Value: 1nf, 1000V; Category: Cap SMD; PackageReference: 1206
  C25 C27: Value: 1nf, 1KV; Category: Cap TH; PackageReference: Disck, 5mm Space Pin
  C26: Value: 1nf, 1KV; Category: Cap TH; PackageReference: Disk 5mm Space pin
  C28: Value: 1uf; Category: Cap SMD; PackageReference: 0805
  C29 C71: Value: 10nf; Category: Cap SMD; PackageReference: 0805
  C65 C66: Value: 100nf, 50V; Category: Cap SMD; PackageReference: 0805
  C67: Value: 4.7nf, 50V; Category: Cap SMD; PackageReference: 0805
  C69: Value: 330pf, 50V; Category: Cap SMD; PackageReference: 0805
CN1 CN2 CN7-CN10 = Socket
  CN1 CN2: Category: Connector TH; PackageReference: Connector-Lug; Value: Cable Lug
  CN7-CN10: Category: Hole-Wire; PackageReference: Hole-Wire; Value: Hole-Wire
CN3 = Header 6: Category: Connector TH; PackageReference: XH-6Right-F/M; Value: XH-6Right-F/M
CN4 CN6 = Header 2: Category: Connector TH
  CN4: PackageReference: XH-2Right-F/M; Value: XH-2Right-F/M
  CN6: PackageReference: XH-2-F/M; Value: XH-2-F/M
CN5 = Header 5: Category: Connector TH; PackageReference: VH-5; Value: VH-5
D1 D2 = MUR460
  D1: PackageReference: SOD-123-2; Value: 1N4148; Category: Diode TH
  D2: PackageReference: SMA; Value: SS14; Category: Diode SMD; Partnumber: =Comment
D3 D4 D6 D8 D10 = DSEP30-06A: Category: Diode TH
  D3 D4: PackageReference: DO-201AD; Value: 1N5406 or 1N5408, 600V, 6A/8A
  D6 D8 D10: PackageReference: TO-247-F2; Value: DSEP30-06
D5 = Diode Zener Mini Melf: Value: 1N5354, 17V; Category: Diode TH; PackageReference: D0-204
D9 D13 D16 D20-D22 D215 = Diode
  D9 D13 D16 D22: PackageReference: SOD-123-2; Category: Diode SMD; Value: 1N4148
  D20: PackageReference: SOD-57; Category: Diode TH; Value: BYV26E
  D21: PackageReference: SMA; Category: Diode SMD; Value: US1M(700V)
  D215: PackageReference: SMA; Category: Diode SMD; Value: US1M
D12 D14 = Diode 1N4148: PackageReference: SMA; Category: Diode SMD; Partnumber: =Comment; Value: US1M(700V)
D15 = LED0: PackageReference: 0805; Category: LED SMD; Value: Green
D17 = Bridge KBL: Category: Diode TH; Value: KBP207(206); PackageReference: Bridge Diode TH
D18 = Diode MeanWell-1: Value: CSF30L200CT; Category: Diode TH; PackageReference: TO-220F
F1 F3 = Fuse 2: Category: Fuse TH
  F1: PackageReference: Fuse 5x20; Value: 20A, 250VAC-HV/HC
  F3: PackageReference: 20mmx5mm; Value: 2A, 250Vac
HS1-HS3 = HeatSink: Category: Heat Sink
  HS1: PackageReference: 180x125x55mm/81.03x40.04x150mm; Value: HS154Heatalum/HS134Ayda
  HS2: PackageReference: 3mm Aluminium; Value: 3mm Aluminium
  HS3: PackageReference: NSC-Heat Sink; Value: NSC-Heat Sink
J1 J1A J2 J2A = Jumper: Value: Wire Jumper 5mm; Category: Wire Jumper; PackageReference: Wire Jumper-5mm
L1 L2 L6 = Trans Cupl: PackageReference: TH 40mm*25mm; Value: 3.3mH; Category: Inductor EMI TH
L3-L5 L7 = Inductor: Category: Inductor TH
  L3-L5: PackageReference: PQ3232; Value: 204uH-PQ3232(39.5Turn 30x0.2mm)
  L7: PackageReference: Can 9x12; Value: 100uH, 9x12
LED1 LED3 = Diode LED1 SMD: Value: Green; Category: LED SMD; PackageReference: 0805
MOV1 MOV3 = B72207S2301K101: Category: Varistor TH
  MOV1: Value: 470K 20D(300AC,385VDC); PackageReference: Disc 20mm
  MOV3: Value: 07D220K-5mm Space pin-14AC/18DC/22Var; PackageReference: Disc 7mm
NTC1 NTC2 = Res2: Category: NTC TH
  NTC1: PackageReference: Disc 20mm; Value: 10D-20(10R-20mm)
  NTC2: PackageReference: Disc 15mm; Value: 4.7D-15(4.7R-15mm)
P1 = Relay-SPDT: PackageReference: MODULE5B; Category: Relay TH; Value: 832A-1A-S-BH, 12VDC, Song Chuan, 30A
Q1 = BCW68G: PackageReference: SOT-23; Value: BC807; Category: Transistor SMD
Q4 Q7 Q10 = MOSFET N-CH: PackageReference: TO-247; Value: IPW60R070; Category: Mosfet TH
Q11 Q14 Q16 Q18 = BC817-40: PackageReference: SOT-23; Value: BC817; Category: Transistor SMD
Q13 = IRF530N: PackageReference: TO-220F; Category: Mosfet TH; Value: FCPF16N60(2SK3569)
R1-R3 R3A R3B R4-R7 R7A R8-R14 R16-R27 R27A R28-R41 R43 R45-R47 R47A R47B R48-R50 R52 R52A R53-R55 R55A R56 R56A R57-R60 R60A R61-R69 R69A R70 R72 R73 R75-R77 R79-R88 R91-R93 = Res1
  R1 R4: Value: 10K, 2W; Category: Resistor TH; PackageReference: Axial 0.4
  R2 R81 R85: Value: 1K; Category: Resistor SMD; PackageReference: 0805
  R3 R3A R3B: Value: 100R; Category: Resistor SMD; PackageReference: 1206
  R5 R6: PackageReference: 1206; Value: 1M; Category: Resistor SMD
  R7: PackageReference: 1206; Value: 6M; Category: Resistor SMD
  R7A: PackageReference: 1206; Value: 0R; Category: Resistor SMD
  R8: PackageReference: 1206; Value: 470K; Category: Resistor SMD
  R9 R26 R41 R43 R75 R80 R91: Value: 1K; PackageReference: 0805; Category: Resistor SMD
  R10: PackageReference: 1206; Value: 2.2M; Category: Resistor SMD
  R11 R18 R19 R21 R28 R29 R31 R38 R39: PackageReference: 0805; Value: 470R; Category: Resistor SMD
  R12 R22 R32: PackageReference: 0805; Value: 10R; Category: Resistor SMD
  R13 R23 R33: PackageReference: 0805; Value: 2.2R; Category: Resistor SMD
  R14 R24 R34 R68: PackageReference: 0805; Value: 10K; Category: Resistor SMD
  R16: Value: 10R; Category: Resistor SMD; PackageReference: 1206
  R17 R48 R49 R92 R93: Value: 10K; PackageReference: 0805; Category: Resistor SMD
  R20: PackageReference: 1206; Value: 1.5M; Category: Resistor SMD
  R25 R35 R45: PackageReference: 2512; Value: 20mOhm; Category: Resistor SMD
  R27 R27A: Category: Resistor SMD; PackageReference: 1206; Value: 1K
  R30: Value: 5.6K; PackageReference: 0805; Category: Resistor SMD
  R36 R37 R40 R76: Value: 47K; Category: Resistor SMD; PackageReference: 0805
  R46 R88: Value: 3.3K; Category: Resistor SMD; PackageReference: 0805
  R47: Value: Short Cicuit; Category: Resistor SMD; PackageReference: 1206
  R47A R47B: Value: 0R; Category: Resistor SMD; PackageReference: 1206
  R50: Value: 22R; Category: Resistor SMD; PackageReference: 0805
  R52 R55: PackageReference: 0805; Value: 33K; Category: Resistor SMD
  R52A: PackageReference: 0805; Value: 82K; Category: Resistor SMD
  R53: PackageReference: 0805; Value: 120K; Category: Resistor SMD
  R54: PackageReference: 1206; Value: 200K; Category: Resistor SMD
  R55A: PackageReference: 0805; Value: 820K; Category: Resistor SMD
  R56: PackageReference: 1206; Value: 820K; Category: Resistor SMD
  R56A: PackageReference: 1206; Value: 4.7M; Category: Resistor SMD
  R57 R60A: PackageReference: 0805; Value: 22K; Category: Resistor SMD
  R58 R62-R64: PackageReference: 0805; Value: 39K; Category: Resistor SMD
  R59: PackageReference: 0805; Value: 20K; Category: Resistor SMD
  R60 R73: PackageReference: 0805; Value: 12K; Category: Resistor SMD
  R61 R72: PackageReference: 0805; Value: 4.7K; Category: Resistor SMD
  R65-R67 R70: PackageReference: 0805; Value: 0R; Category: Resistor SMD
  R69: PackageReference: 0805; Value: 56K; Category: Resistor SMD
  R69A: PackageReference: 0805; Value: 150K; Category: Resistor SMD
  R77: Value: 100K, 2W; Category: Resistor TH; PackageReference: Axial 0.4
  R79 R87: Value: 10K; Category: Resistor SMD; PackageReference: 0805
  R82: Value: 820R; Category: Resistor SMD; PackageReference: 0805
  R83: Value: 0.82, 2W; Category: Resistor SMD; PackageReference: Axial 0.3
  R84: Value: 27K; Category: Resistor SMD; PackageReference: 0805
  R86: Value: 2.2K; Category: Resistor SMD; PackageReference: 0805
R89 = Res Semi: Value: 330K-Axial 0.8; Category: Resistor TH; PackageReference: Axial 0.8
T1 = flyback-ILPFC-2: Value: EE2525; Category: Transformer TH; PackageReference: EE2525
TP1-TP4 TP6-TP8 = TEST POINT: Assembly: DNP; Category: Test Point; PackageReference: Test Point
  TP1: Value: PGND
  TP2: Value: G3
  TP3: Value: G2
  TP4: Value: G1
  TP6: Value: +15V
  TP7: Value: IAC
  TP8: Value: RMS
TP5 = TEST POINT: Value: FB; Category: Test Point; PackageReference: Test Point
U1 = MC7808CT: Value: 7815A; Category: IC TH; PackageReference: TO-220F
U2 U5 U7 = TLP521: PackageReference: DIP-4; Value: PC817; Category: IC TH
U6 = UC3842: Category: IC SMD; PackageReference: SO8; Value: UC3845
ZD1 = D Zener: Value: 1N5358B, 22VZ; Category: Diode TH; PackageReference: DO-35-2
Q2 Q5 Q8 = BCX56: PackageReference: SOT89; Category: Transistor SMD; Value: BCX56
Q3 Q6 Q9 = BCX53: PackageReference: SOT89; Category: Transistor SMD; Value: BCX53
Q17 = BD137: Category: Transistor TH; PackageReference: TO-126; Value: BD137
U4 = FAN9673: Category: IC SMD; PackageReference: LQFP-32; Value: FAN9673
U202 = TL431ACD: PackageReference: SO8; Category: IC SMD; Value: TL431ACD